# EAGLE schematic GP-ScratchPlayground-v00 (EAGLE 5.10)
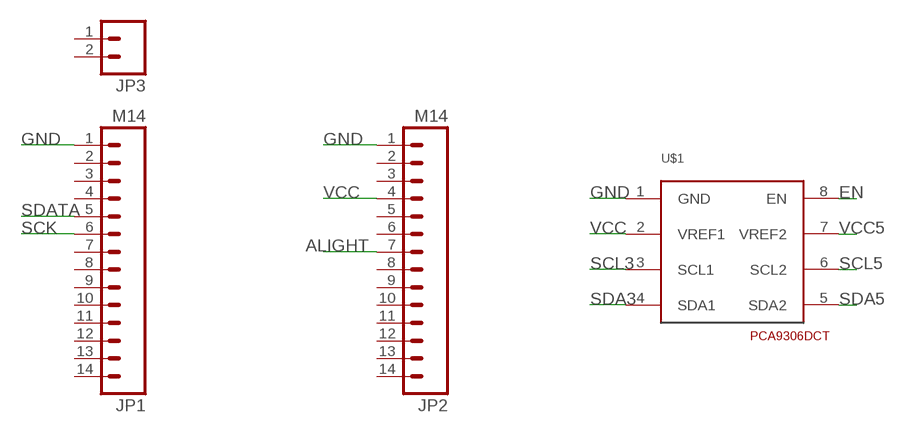
[diagram p0: schematic, sheet 1]

## Parts
JP1  M14  [1X14]
JP2  M14  [1X14]
JP3  M02PTH  [1X02]
U$1  PCA9306DCT  [DCT]

## Nets
ALIGHT: JP2.7
EN: U$1.8(EN)
GND: JP1.1 JP2.1 U$1.1(GND)
SCK: JP1.6
SCL3: U$1.3(SCL1)
SCL5: U$1.6(SCL2)
SDA3: U$1.4(SDA1)
SDA5: U$1.5(SDA2)
SDATA: JP1.5
VCC: JP2.4 U$1.2(VREF1)
VCC5: U$1.7(VREF2)
Unconnected: JP1.2 JP1.3 JP1.4 JP1.7 JP1.8 JP1.9 JP1.10 JP1.11 JP1.12 JP1.13 JP1.14 JP2.2 JP2.3 JP2.5 JP2.6 JP2.8 JP2.9 JP2.10 JP2.11 JP2.12 JP2.13 JP2.14 JP3.1 JP3.2

## Library data of the parts
JP1 JP2 = SparkFun:M14: Header 14 Standard 14-pin 0.1" header. Use with straight break away headers (SKU : PRT-00116), right angle break away headers (PRT-00553), swiss pins (PRT-00743), machine pins (PRT-00117), and female headers (PRT-00115).
JP3 = SparkFun:M02: Header 2 Standard 2-pin 0.1" header. Use with straight break away headers (SKU : PRT-00116), right angle break away headers (PRT-00553), swiss pins (PRT-00743), machine pins (PRT-00117), and female headers (PRT-00115). Molex polarized connector foot print use with SKU : PRT-08233 with associated crimp pins and housings.
U$1 = 0_jc-custom:PCA9306